# Altium schematic sheet CAN-Interface.SchDoc
size A4
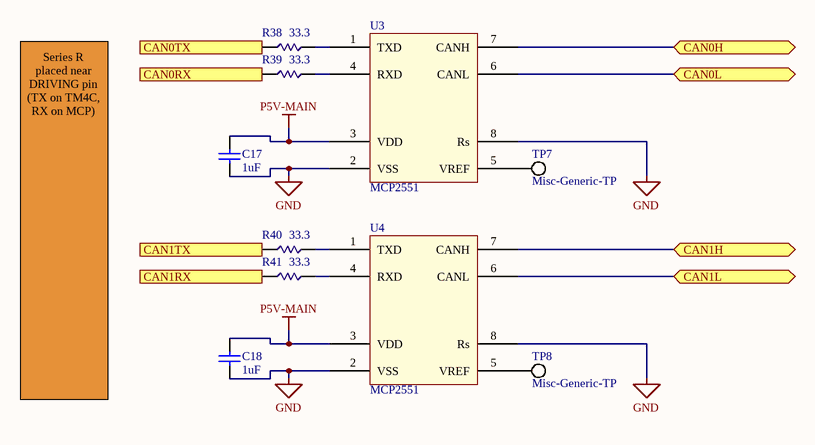
[diagram p0: CAN-Interface.SchDoc]

## Parts
C17  value 1uF  [FOOTPRINT-0805-GEN]  (hidden comment: C0805C105K8RACTU)
C18  value 1uF  [FOOTPRINT-0805-GEN]  (hidden comment: C0805C105K8RACTU)
R38  value 33.3  [FOOTPRINT-0805-GEN]  (hidden comment: SMC)
R39  value 33.3  [FOOTPRINT-0805-GEN]  (hidden comment: SMC)
R40  value 33.3  [FOOTPRINT-0805-GEN]  (hidden comment: SMC)
R41  value 33.3  [FOOTPRINT-0805-GEN]  (hidden comment: SMC)
TP7  Misc-Generic-TP  [FOOTPRINT-GENERIC-TP-SMD-1MM]
TP8  Misc-Generic-TP  [FOOTPRINT-GENERIC-TP-SMD-1MM]
U3  MCP2551  [FOOTPRINT-SOIC-8PIN]
U4  MCP2551  [FOOTPRINT-SOIC-8PIN]

## Ports
CAN0H (bidir), CAN0L (bidir), CAN0RX (out), CAN0TX (in), CAN1H (bidir), CAN1L (bidir), CAN1RX (out), CAN1TX (in)

## Nets
GND: C17.1 C18.1 U3.2(VSS) U3.8(Rs) U4.2(VSS) U4.8(Rs)
P5V-MAIN: C17.2 C18.2 U3.3(VDD) U4.3(VDD)
CAN0H: U3.7(CANH) ; port CAN0H
CAN0L: U3.6(CANL) ; port CAN0L
CAN0RX: R39.1 ; port CAN0RX
CAN0TX: R38.1 ; port CAN0TX
CAN1H: U4.7(CANH) ; port CAN1H
CAN1L: U4.6(CANL) ; port CAN1L
CAN1RX: R41.1 ; port CAN1RX
CAN1TX: R40.1 ; port CAN1TX
NetR38_2: R38.2 U3.1(TXD)
NetR39_2: R39.2 U3.4(RXD)
NetR40_2: R40.2 U4.1(TXD)
NetR41_2: R41.2 U4.4(RXD)
NetTP7_1: TP7.1(TP) U3.5(VREF)
NetTP8_1: TP8.1(TP) U4.5(VREF)

## Notes on the sheet
- Series R placed near DRIVING pin (TX on TM4C, RX on MCP)
- Title
- Size:
- Date:
- Engineer
- A4
- Number:
- Sheet
- of
- Approved
- Revision:
- UC Riverside
- www.highlanderracing.org <https://www.highlanderracing.org>
- File:

## Library data of the parts
C17 C18 = Capacitor-Generic-0805: Capacitor; Published: 8-Jun-2000; LatestRevisionDate: 17-Jul-2002; LatestRevisionNote: Re-released for DXP Platform.; PackageReference: RAD-0.3; Publisher: Altium Limited; PackageDescription: Radial Cap, Thru-Hole; 2 Leads; 0.3 in Pin Spacing
R38-R41 = Resistor-Generic-0805-2012: 1/8 Watt Surface Mount Resistor
U3 U4 = IC-MCP-MCP2551